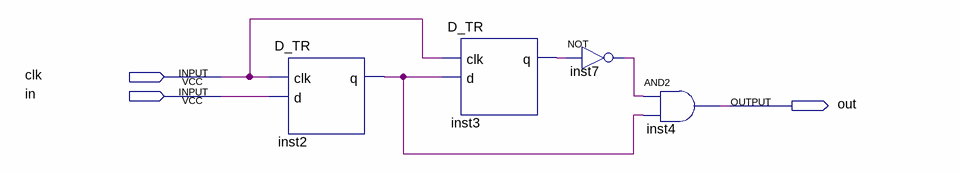
[diagram p0: schematic sheet]
// Quartus schematic impulse.bdf as structural Verilog: 4 symbols, 3 pins
module impulse (
  input  clk,
  input  in,
  output out
);

  wire inst2_q, inst3_q, inst7_out;

  D_TR inst2 (.clk(clk), .d(in), .q(inst2_q));
  D_TR inst3 (.clk(clk), .d(inst2_q), .q(inst3_q));
  not inst7 (inst7_out, inst3_q);
  and inst4 (out, inst7_out, inst2_q);
endmodule
